# Altium schematic sheet PCIE_Arria10.SchDoc: PCIE & Ethernet
size B; DocumentNumber: 24; SheetNumber: 24; SheetTotal: 46
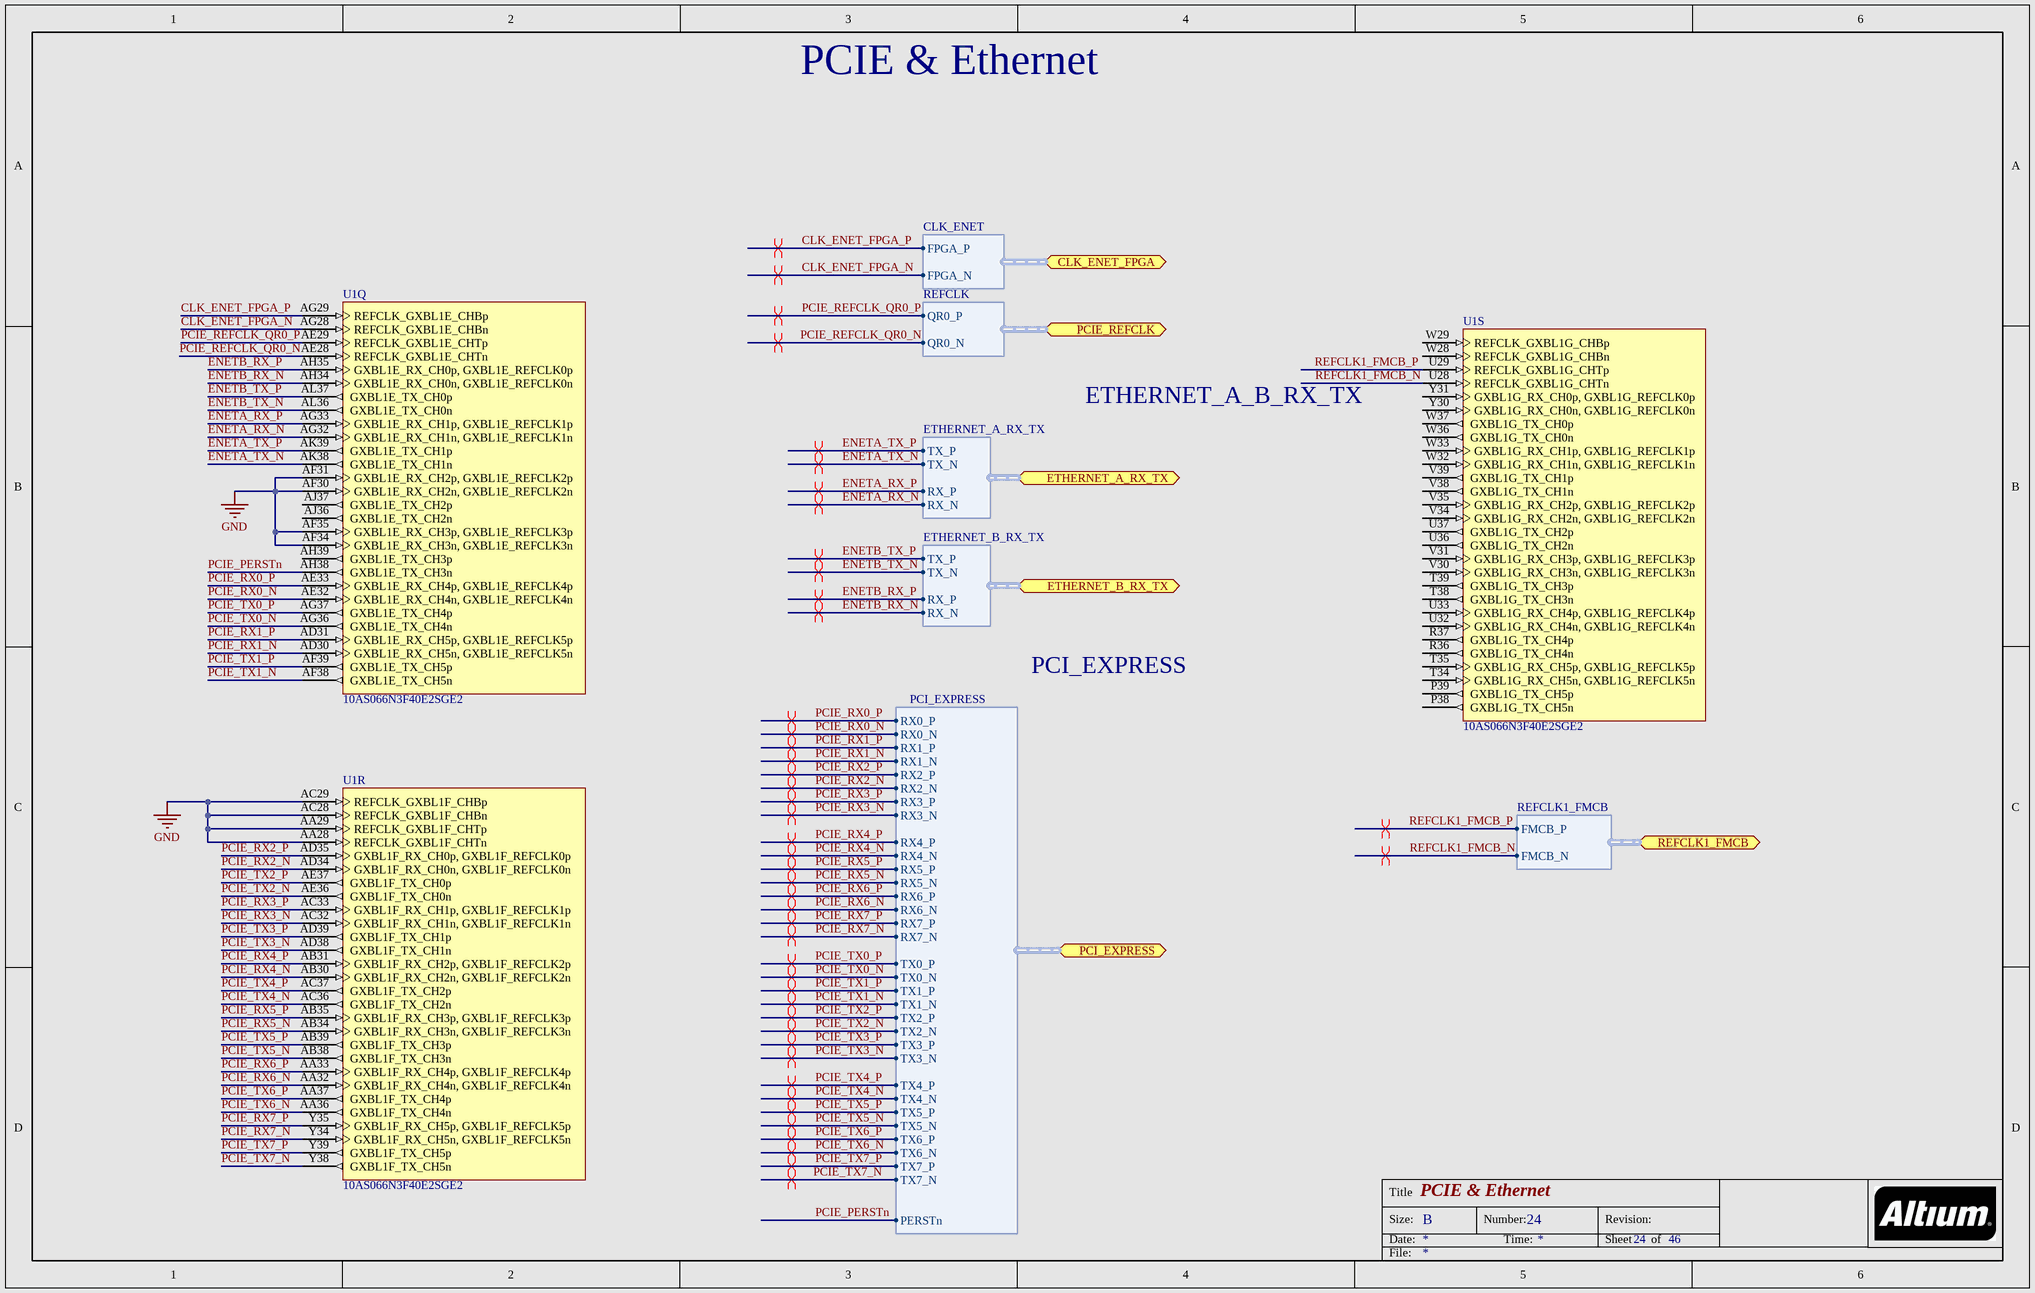
[diagram p0: PCIE_Arria10.SchDoc]

## Parts
U1  10AS066N3F40E2SGE2  [ALTR-FBGA1517_A-350]  (parts Q,R,S of 31)

## Ports
CLK_ENET_FPGA (harness CLK_ENET), ETHERNET_A_RX_TX (harness ETHERNET_A_RX_TX), ETHERNET_B_RX_TX (harness ETHERNET_B_RX_TX), PCI_EXPRESS (harness PCI_EXPRESS), PCIE_REFCLK (harness REFCLK), REFCLK1_FMCB (harness REFCLK1_FMCB)

## Harnesses
ETHERNET_A_RX_TX: RX_P, RX_N, TX_P, TX_N
ETHERNET_B_RX_TX: RX_P, RX_N, TX_P, TX_N
PCI_EXPRESS: RX0_P, RX0_N, RX1_P, RX1_N, RX2_P, RX2_N, RX3_P, RX3_N, RX7_N, RX7_P, RX4_P, RX4_N, RX5_P, RX5_N, RX6_P, RX6_N, TX0_P, TX0_N, TX1_P, TX1_N, TX2_P, TX2_N, TX3_P, TX3_N, TX7_N, TX7_P, TX4_P, TX4_N, TX5_P, TX5_N, TX6_P, TX6_N, PERSTn
CLK_ENET: FPGA_P, FPGA_N
REFCLK: QR0_P, QR0_N
REFCLK1_FMCB: FMCB_P, FMCB_N

## Nets
GND: U1.AA28(REFCLK_GXBL1F_CHTn) U1.AA29(REFCLK_GXBL1F_CHTp) U1.AC28(REFCLK_GXBL1F_CHBn) U1.AC29(REFCLK_GXBL1F_CHBp) U1.AF30(GXBL1E_RX_CH2n,_GXBL1E_REFCLK2n) U1.AF31(GXBL1E_RX_CH2p,_GXBL1E_REFCLK2p) U1.AF34(GXBL1E_RX_CH3n,_GXBL1E_REFCLK3n) U1.AF35(GXBL1E_RX_CH3p,_GXBL1E_REFCLK3p)
CLK_ENET_FPGA_N: U1.AG28(REFCLK_GXBL1E_CHBn) ; port CLK_ENET_FPGA.FPGA_N
CLK_ENET_FPGA_P: U1.AG29(REFCLK_GXBL1E_CHBp) ; port CLK_ENET_FPGA.FPGA_P
ENETA_RX_N: U1.AG32(GXBL1E_RX_CH1n,_GXBL1E_REFCLK1n) ; port ETHERNET_A_RX_TX.RX_N
ENETA_RX_P: U1.AG33(GXBL1E_RX_CH1p,_GXBL1E_REFCLK1p) ; port ETHERNET_A_RX_TX.RX_P
ENETA_TX_N: U1.AK38(GXBL1E_TX_CH1n) ; port ETHERNET_A_RX_TX.TX_N
ENETA_TX_P: U1.AK39(GXBL1E_TX_CH1p) ; port ETHERNET_A_RX_TX.TX_P
ENETB_RX_N: U1.AH34(GXBL1E_RX_CH0n,_GXBL1E_REFCLK0n) ; port ETHERNET_B_RX_TX.RX_N
ENETB_RX_P: U1.AH35(GXBL1E_RX_CH0p,_GXBL1E_REFCLK0p) ; port ETHERNET_B_RX_TX.RX_P
ENETB_TX_N: U1.AL36(GXBL1E_TX_CH0n) ; port ETHERNET_B_RX_TX.TX_N
ENETB_TX_P: U1.AL37(GXBL1E_TX_CH0p) ; port ETHERNET_B_RX_TX.TX_P
PCIE_PERSTn: U1.AH38(GXBL1E_TX_CH3n) ; port PCI_EXPRESS.PERSTn
PCIE_REFCLK_QR0_N: U1.AE28(REFCLK_GXBL1E_CHTn) ; port PCIE_REFCLK.QR0_N
PCIE_REFCLK_QR0_P: U1.AE29(REFCLK_GXBL1E_CHTp) ; port PCIE_REFCLK.QR0_P
PCIE_RX0_N: U1.AE32(GXBL1E_RX_CH4n,_GXBL1E_REFCLK4n) ; port PCI_EXPRESS.RX0_N
PCIE_RX0_P: U1.AE33(GXBL1E_RX_CH4p,_GXBL1E_REFCLK4p) ; port PCI_EXPRESS.RX0_P
PCIE_RX1_N: U1.AD30(GXBL1E_RX_CH5n,_GXBL1E_REFCLK5n) ; port PCI_EXPRESS.RX1_N
PCIE_RX1_P: U1.AD31(GXBL1E_RX_CH5p,_GXBL1E_REFCLK5p) ; port PCI_EXPRESS.RX1_P
PCIE_RX2_N: U1.AD34(GXBL1F_RX_CH0n,_GXBL1F_REFCLK0n) ; port PCI_EXPRESS.RX2_N
PCIE_RX2_P: U1.AD35(GXBL1F_RX_CH0p,_GXBL1F_REFCLK0p) ; port PCI_EXPRESS.RX2_P
PCIE_RX3_N: U1.AC32(GXBL1F_RX_CH1n,_GXBL1F_REFCLK1n) ; port PCI_EXPRESS.RX3_N
PCIE_RX3_P: U1.AC33(GXBL1F_RX_CH1p,_GXBL1F_REFCLK1p) ; port PCI_EXPRESS.RX3_P
PCIE_RX4_N: U1.AB30(GXBL1F_RX_CH2n,_GXBL1F_REFCLK2n) ; port PCI_EXPRESS.RX4_N
PCIE_RX4_P: U1.AB31(GXBL1F_RX_CH2p,_GXBL1F_REFCLK2p) ; port PCI_EXPRESS.RX4_P
PCIE_RX5_N: U1.AB34(GXBL1F_RX_CH3n,_GXBL1F_REFCLK3n) ; port PCI_EXPRESS.RX5_N
PCIE_RX5_P: U1.AB35(GXBL1F_RX_CH3p,_GXBL1F_REFCLK3p) ; port PCI_EXPRESS.RX5_P
PCIE_RX6_N: U1.AA32(GXBL1F_RX_CH4n,_GXBL1F_REFCLK4n) ; port PCI_EXPRESS.RX6_N
PCIE_RX6_P: U1.AA33(GXBL1F_RX_CH4p,_GXBL1F_REFCLK4p) ; port PCI_EXPRESS.RX6_P
PCIE_RX7_N: U1.Y34(GXBL1F_RX_CH5n,_GXBL1F_REFCLK5n) ; port PCI_EXPRESS.RX7_N
PCIE_RX7_P: U1.Y35(GXBL1F_RX_CH5p,_GXBL1F_REFCLK5p) ; port PCI_EXPRESS.RX7_P
PCIE_TX0_N: U1.AG36(GXBL1E_TX_CH4n) ; port PCI_EXPRESS.TX0_N
PCIE_TX0_P: U1.AG37(GXBL1E_TX_CH4p) ; port PCI_EXPRESS.TX0_P
PCIE_TX1_N: U1.AF38(GXBL1E_TX_CH5n) ; port PCI_EXPRESS.TX1_N
PCIE_TX1_P: U1.AF39(GXBL1E_TX_CH5p) ; port PCI_EXPRESS.TX1_P
PCIE_TX2_N: U1.AE36(GXBL1F_TX_CH0n) ; port PCI_EXPRESS.TX2_N
PCIE_TX2_P: U1.AE37(GXBL1F_TX_CH0p) ; port PCI_EXPRESS.TX2_P
PCIE_TX3_N: U1.AD38(GXBL1F_TX_CH1n) ; port PCI_EXPRESS.TX3_N
PCIE_TX3_P: U1.AD39(GXBL1F_TX_CH1p) ; port PCI_EXPRESS.TX3_P
PCIE_TX4_N: U1.AC36(GXBL1F_TX_CH2n) ; port PCI_EXPRESS.TX4_N
PCIE_TX4_P: U1.AC37(GXBL1F_TX_CH2p) ; port PCI_EXPRESS.TX4_P
PCIE_TX5_N: U1.AB38(GXBL1F_TX_CH3n) ; port PCI_EXPRESS.TX5_N
PCIE_TX5_P: U1.AB39(GXBL1F_TX_CH3p) ; port PCI_EXPRESS.TX5_P
PCIE_TX6_N: U1.AA36(GXBL1F_TX_CH4n) ; port PCI_EXPRESS.TX6_N
PCIE_TX6_P: U1.AA37(GXBL1F_TX_CH4p) ; port PCI_EXPRESS.TX6_P
PCIE_TX7_N: U1.Y38(GXBL1F_TX_CH5n) ; port PCI_EXPRESS.TX7_N
PCIE_TX7_P: U1.Y39(GXBL1F_TX_CH5p) ; port PCI_EXPRESS.TX7_P
REFCLK1_FMCB_N: U1.U28(REFCLK_GXBL1G_CHTn) ; port REFCLK1_FMCB.FMCB_N
REFCLK1_FMCB_P: U1.U29(REFCLK_GXBL1G_CHTp) ; port REFCLK1_FMCB.FMCB_P

Not connected (* = marked no-connect by the designer): U1 AH39(GXBL1E_TX_CH3p) AJ36(GXBL1E_TX_CH2n) AJ37(GXBL1E_TX_CH2p) P38(GXBL1G_TX_CH5n) P39(GXBL1G_TX_CH5p) R36(GXBL1G_TX_CH4n) R37(GXBL1G_TX_CH4p) T34(GXBL1G_RX_CH5n,_GXBL1G_REFCLK5n) T35(GXBL1G_RX_CH5p,_GXBL1G_REFCLK5p) T38(GXBL1G_TX_CH3n) T39(GXBL1G_TX_CH3p) U32(GXBL1G_RX_CH4n,_GXBL1G_REFCLK4n) U33(GXBL1G_RX_CH4p,_GXBL1G_REFCLK4p) U36(GXBL1G_TX_CH2n) U37(GXBL1G_TX_CH2p) V30(GXBL1G_RX_CH3n,_GXBL1G_REFCLK3n) V31(GXBL1G_RX_CH3p,_GXBL1G_REFCLK3p) V34(GXBL1G_RX_CH2n,_GXBL1G_REFCLK2n) V35(GXBL1G_RX_CH2p,_GXBL1G_REFCLK2p) V38(GXBL1G_TX_CH1n) V39(GXBL1G_TX_CH1p) W28(REFCLK_GXBL1G_CHBn) W29(REFCLK_GXBL1G_CHBp) W32(GXBL1G_RX_CH1n,_GXBL1G_REFCLK1n) W33(GXBL1G_RX_CH1p,_GXBL1G_REFCLK1p) W36(GXBL1G_TX_CH0n) W37(GXBL1G_TX_CH0p) Y30(GXBL1G_RX_CH0n,_GXBL1G_REFCLK0n) Y31(GXBL1G_RX_CH0p,_GXBL1G_REFCLK0p)

## Layout directives
differential pair: CLK_ENET_FPGA_N, CLK_ENET_FPGA_P, ENETA_RX_N, ENETA_RX_P, ENETA_TX_N, ENETA_TX_P, ENETB_RX_N, ENETB_RX_P, ENETB_TX_N, ENETB_TX_P, PCIE_REFCLK_QR0_N, PCIE_REFCLK_QR0_P, PCIE_RX0_N, PCIE_RX0_P, PCIE_RX1_N, PCIE_RX1_P, PCIE_RX2_N, PCIE_RX2_P, PCIE_RX3_N, PCIE_RX3_P, PCIE_RX4_N, PCIE_RX4_P, PCIE_RX5_N, PCIE_RX5_P, PCIE_RX6_N, PCIE_RX6_P, PCIE_RX7_N, PCIE_RX7_P, PCIE_TX0_N, PCIE_TX0_P, PCIE_TX1_N, PCIE_TX1_P, PCIE_TX2_N, PCIE_TX2_P, PCIE_TX3_N, PCIE_TX3_P, PCIE_TX4_N, PCIE_TX4_P, PCIE_TX5_N, PCIE_TX5_P, PCIE_TX6_N, PCIE_TX6_P, PCIE_TX7_N, PCIE_TX7_P, REFCLK1_FMCB_N, REFCLK1_FMCB_P

## Notes on the sheet
- ETHERNET_A_B_RX_TX
- PCI_EXPRESS
- Title
- Size:
- Date:
- B
- Number:
- Time:
- Revision:
- Sheet
- of
- File:

## Library data of the parts
U1 = CMP-1689-00006-3: Arria 10 SX Family, 588 I/O Pins, 16 Fractional PLLs, 1517-Pin FBGA, Speed Grade 2, Extended Grade, RoHS; ComponentLink3Description: Package Specification; PackageVersion: Rev. 5.0, 01/2016; ComponentLink3URL: https://www.altera.com/content/dam/altera-www/global/en_US/pdfs/literature/packaging/04r00461-04.pdf; ComponentLink2Description: Datasheet; Code_JEDEC: MS-034; Mounting Technology: Surface Mount; PartNumber: 10AS066N3F40E2SGE2; PackageDescription: 1517-Pin FineLine Ball-Grid Array (FBGA), Body 40 x 40 mm, Pitch 1 mm; ComponentLink2URL: https://www.altera.com/content/dam/altera-www/global/en_US/pdfs/literature/hb/arria-10/a10_datasheet.pdf; ComponentLink1URL: https://www.altera.com/; DatasheetVersion: Rev. 2016-06-24, 06/2016; ComponentLink1Description: Manufacturer URL